# EasyEDA Pro project 3轴6.1--esp32 -(1031) I2S.eprj, schematic 原理图
Board Name: esp32; Create Date: 2025-05-14; Page Name: 电源; Project Name: 3轴6.1--esp32 -(1031) I2S; Schematic Name: 原理图; Update Date: 2025-11-05; Company: 嘉立创EDA; Page Size: A3; Version: V1.0
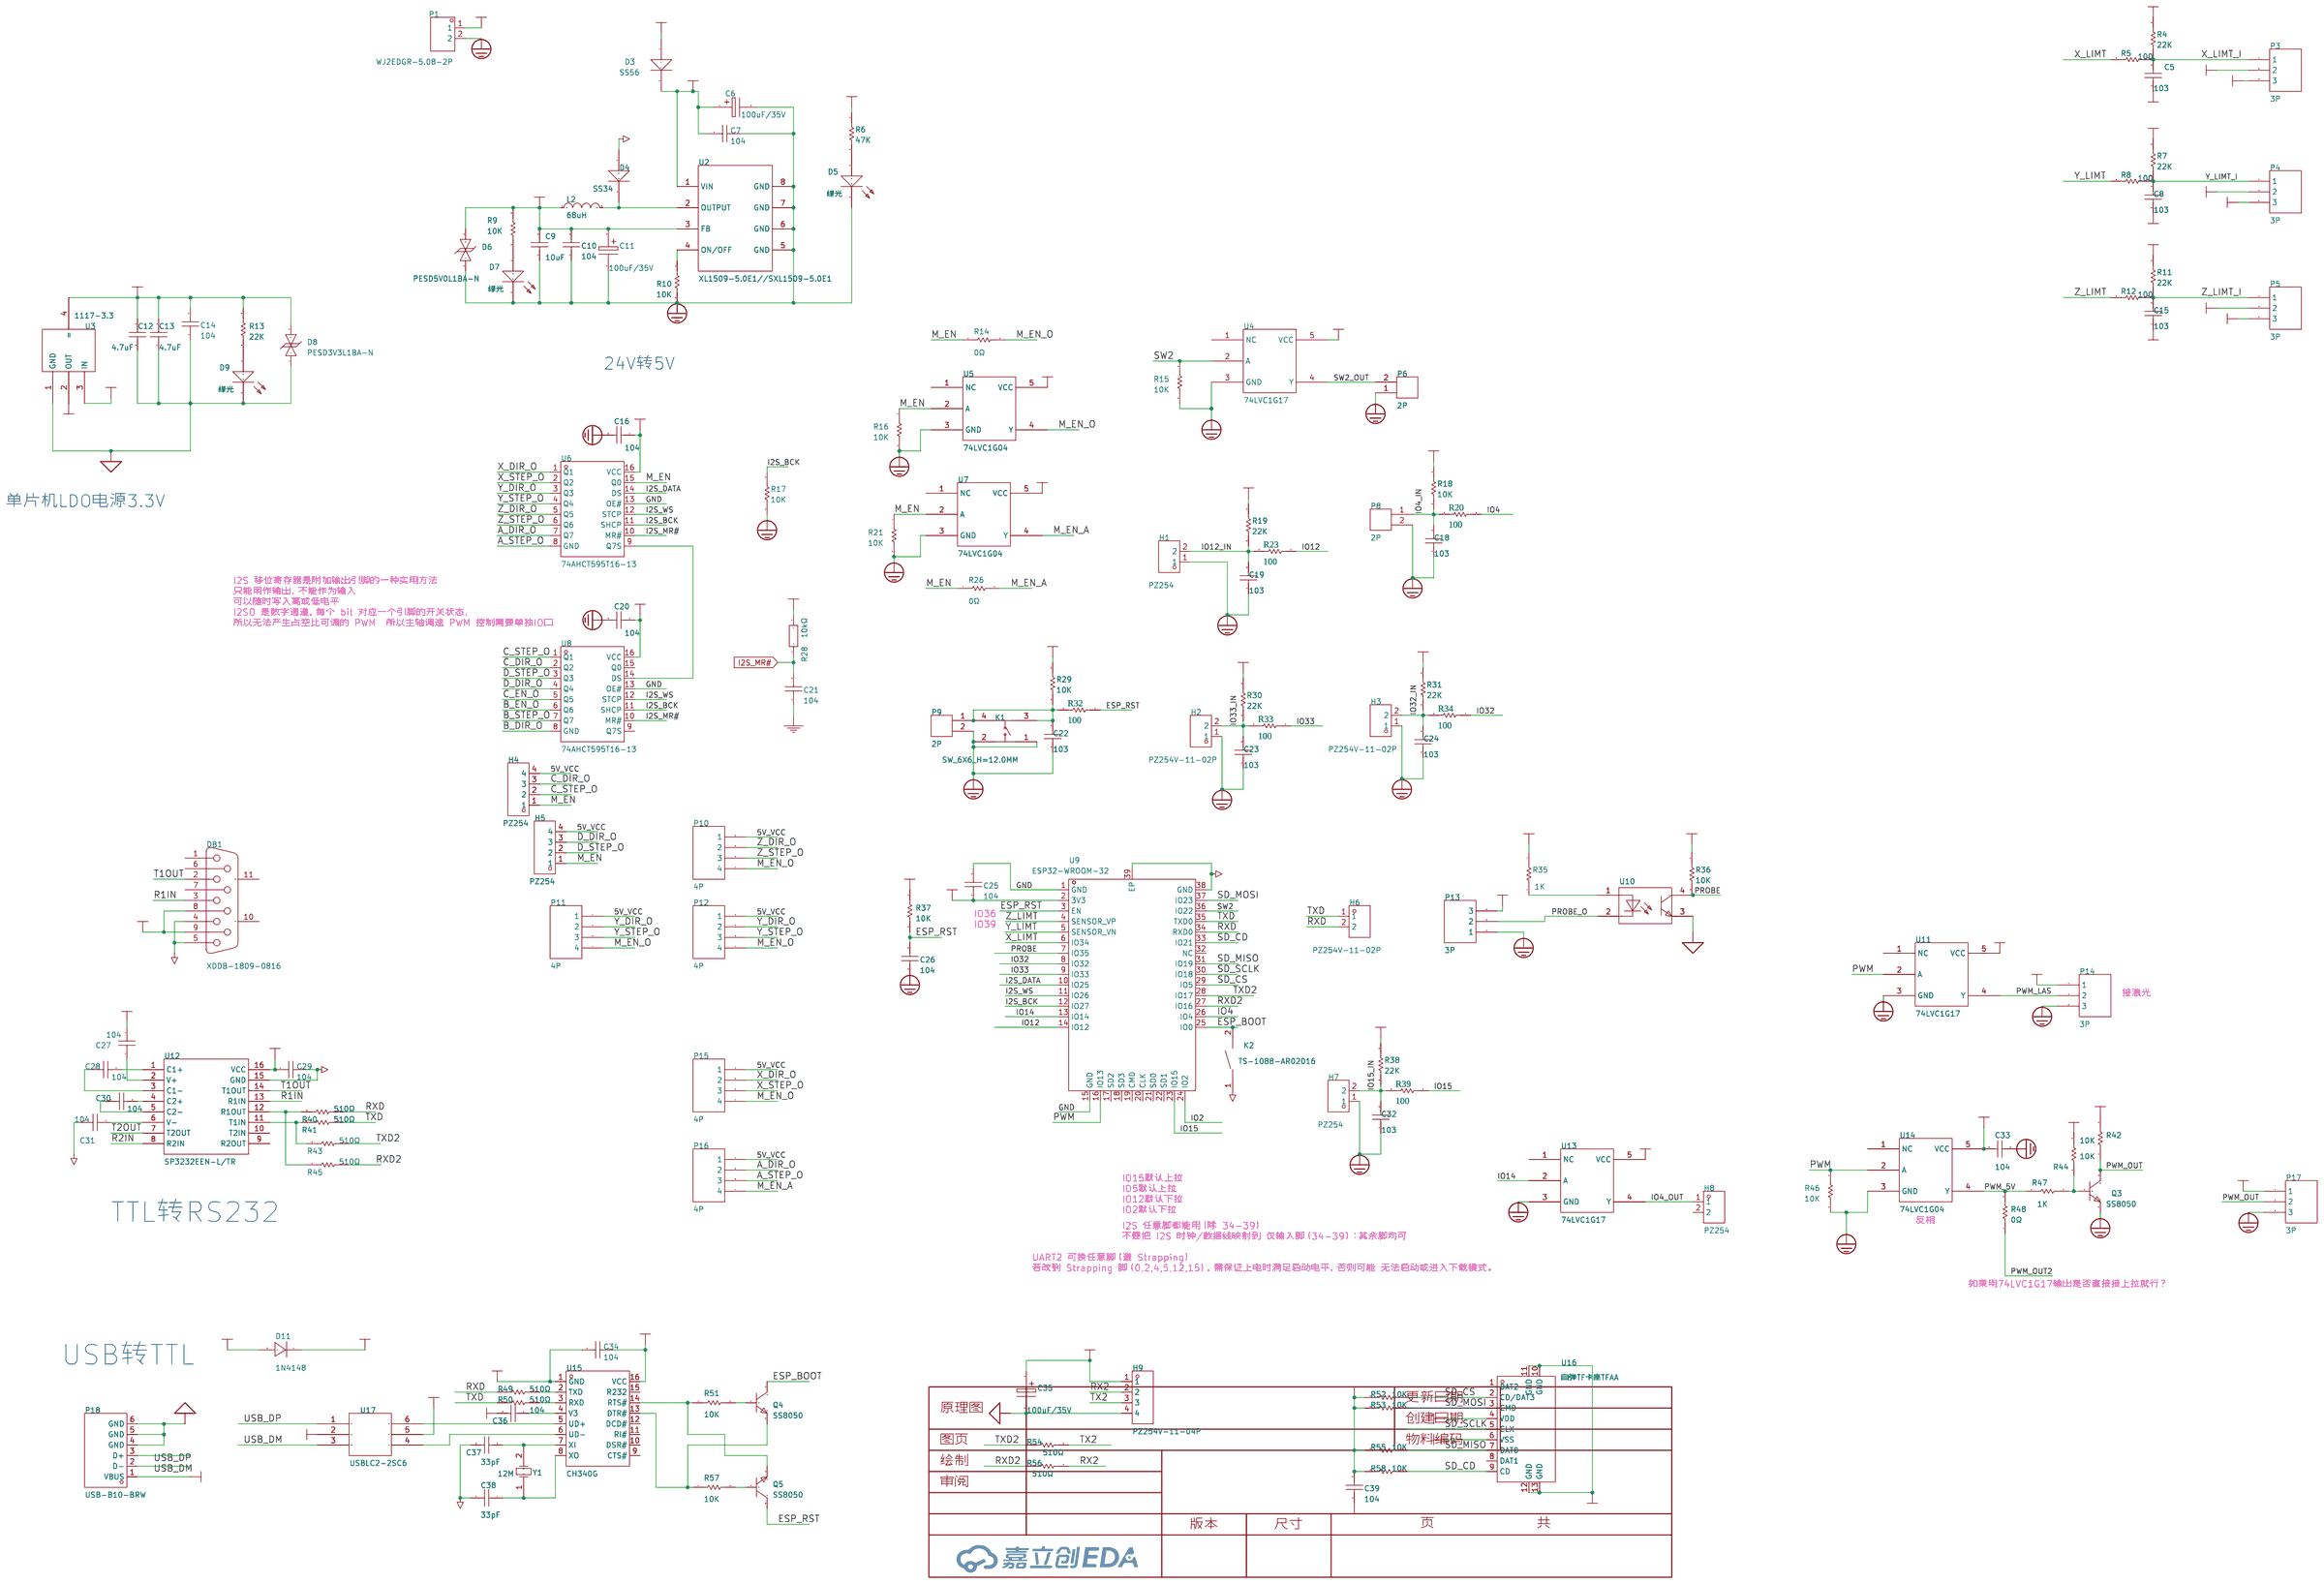
[diagram p0: schematic sheet]

## Parts
C5  103  [11]
C6  100uF/35V  [电解电容贴片6X6]
C7  104  [0603C]
C8  103  [11]
C9  10uF  [C1206]
C10  104  [0603C]
C11  100uF/35V  [电解电容贴片6X6]
C12  4.7uF  [C1206]
C13  4.7uF  [C1206]
C14  104  [0603C]
C15  103  [11]
C16  104  [0603C]
C18  103  [11]
C19  103  [11]
C20  104  [0603C]
C21  104  [0603C]
C22  103  [11]
C23  103  [11]
C24  103  [11]
C25  104  [0603C]
C26  104  [0603C]
C27  104  [0603C]
C28  104  [0603C]
C29  104  [0603C]
C30  104  [0603C]
C31  104  [0603C]
C32  103  [11]
C33  104  [0603C]
C34  104  [0603C]
C35  100uF/35V  [电解电容贴片6X6]
C36  104  [0603C]
C37  18pF  [0603C]
C38  18pF  [0603C]
C39  104  [11]
D3  SS56  [SMA]
D4  SS34  [SMA]
D5  绿光  [0603LED]
D6  PESD5V0L1BA-N  [SOD-323_L1.8-W1.3-LS2.5-BI]
D7  绿光  [0603LED]
D8  PESD3V3L1BA-N  [SOD-323_L1.8-W1.3-LS2.5-BI]
D9  绿光  [0603LED]
D11  1N4148  [SOD-123_L2.8-W1.8-LS3.7-RD]
DB1  XDDB-1809-0816  [DB9-TH_LD09P33E4GV00LF]
H1  PZ254  [HDR-TH_2P-P2.54-V-M]
H2  PZ254V-11-02P  [HDR-TH_2P-P2.54-V-M]
H3  PZ254V-11-02P  [HDR-TH_2P-P2.54-V-M]
H4  PZ254  [HDR-TH_4P-P2.54-V-M]
H5  PZ254  [HDR-TH_4P-P2.54-V-M]
H6  PZ254V-11-02P  [HDR-TH_2P-P2.54-V-M]
H7  PZ254  [HDR-TH_2P-P2.54-V-M]
H8  PZ254  [HDR-TH_2P-P2.54-V-M]
H9  PZ254V-11-04P  [HDR-TH_4P-P2.54-V-M]
K1  SW_6X6_H=12.0MM  [KEY-SMD_4P-L6.0-W6.0-P4.50-LS9.0]
K2  TS-1088-AR02016  [SW-SMD_L3.9-W3.0-P4.45]
L2  68uH  [IND-SMD_L7.0-W7.0_SMDRI74-330MT]
P1  WJ2EDGR-5.08-2P  [CONN-TH_WJ2EDGR-5.08-2P]
P3  3P  [HDR1X3_CON]
P4  3P  [HDR1X3_CON]
P5  3P  [HDR1X3_CON]
P6  2P  [HDR1X2_CON]
P8  2P  [HDR1X2_CON]
P9  2P  [HDR1X2_CON]
P10  4P  [HDR1X4_CON]
P11  4P  [HDR1X4_CON]
P12  4P  [HDR1X4_CON]
P13  3P  [HDR1X3_CON]
P14  3P  [HDR1X3_CON]
P15  4P  [HDR1X4_CON]
P16  4P  [HDR1X4_CON]
P17  3P  [HDR1X3_CON]
P18  USB-B10-BRW  [USB-B-TH_USB-B10-BRW]
Q3  SS8050  [SOT-23-3_L2.9-W1.3-P1.90-LS2.4-BR]
Q4  SS8050  [SOT-23-3_L2.9-W1.3-P1.90-LS2.4-BR]
Q5  SS8050  [SOT-23-3_L2.9-W1.3-P1.90-LS2.4-BR]
R4  22K  [10]
R5  100  [10]
R6  47K  [0603R]
R7  22K  [10]
R8  100  [10]
R9  10K  [0603R]
R10  10K  [0603R]
R11  22K  [10]
R12  100  [10]
R13  10K  [0603R]
R14  0Ω  [0603R]
R15  10K  [0603R]
R16  10K  [0603R]
R17  10K  [0603R]
R18  10K  [0603R]
R19  10K  [0603R]
R20  100  [0603R]
R21  10K  [0603R]
R23  100  [0603R]
R26  0Ω  [0603R]
R28  10kΩ  [R0603]
R29  10K  [0603R]
R30  10K  [0603R]
R31  10K  [0603R]
R32  100  [0603R]
R33  100  [0603R]
R34  100  [0603R]
R35  1K  [0603R]
R36  10K  [0603R]
R37  10K  [0603R]
R38  10K  [0603R]
R39  100  [0603R]
R40  510Ω  [0603R]
R41  510Ω  [0603R]
R42  10K  [0603R]
R43  510Ω  [0603R]
R44  10K  [0603R]
R45  510Ω  [0603R]
R46  10K  [0603R]
R47  1K  [0603R]
R48  0Ω  [0603R]
R49  510Ω  [0603R]
R50  510Ω  [0603R]
R51  10K  [0603R]
R52  10K  [10]
R53  10K  [10]
R54  510Ω  [0603R]
R55  10K  [10]
R56  510Ω  [0603R]
R57  10K  [0603R]
R58  10K  [10]
U2  XL1509-5.0E1//SXL1509-5.0E1  [ESOP-8_L4.9-W3.9-P1.27-LS6.0-BL-EP]
U3  1117-3.3  [SOT-223]
U4  74LVC1G17  [SOT-23-5]
U5  74LVC1G04  [SOT-23-5]
U6  74AHCT595T16-13  [TSSOP-16_L5.0-W4.4-P0.65-LS6.4-BL]
U7  74LVC1G04  [SOT-23-5]
U8  74AHCT595T16-13  [TSSOP-16_L5.0-W4.4-P0.65-LS6.4-BL]
U9  ESP32-WROOM-32  [WIFI-SMD_ESP32-WROOM-32UE-A]
U10  LTV-357T-C  [SOP-4_L4.4-W3.9-P2.54-LS7.0-TL]
U11  74LVC1G17  [SOT-23-5]
U12  SP3232EEN-L/TR  [SOIC-16_L9.9-W3.9-P1.27-LS6.0-BL]
U13  74LVC1G17  [SOT-23-5]
U14  74LVC1G04  [SOT-23-5]
U15  CH340G  [SOIC-16_L9.9-W3.9-P1.27-LS6.0-BL]
U16  自弹TF卡座TFAA  [SIM-SMD_C9900015645]
U17  USBLC2-2SC6  [SOT-23-6]
Y1  12M  [晶振贴片49SSMD]

## Library data of the parts
C5 C8 C15 C18 C19 C22-C24 C32 = 103: Design Item ID: CAP; Library Name: SCH封装库
C6 C11 C35 = 100uF/35V: Origin Footprint 2: X47U; Origin Footprint 1: 电解电容贴片6x6; Design Item ID: ELECTRO1; Library Name: *
C7 C10 C14 C16 C20 C21 C25 C26 C33 = 104: Capacitor (Semiconductor SIM Model); Published: 8-Jun-2000; LatestRevisionDate: 17-Jul-2002; LatestRevisionNote: Re-released for DXP Platform.; PackageReference: C1206; Publisher: Altium Limited; Origin Footprint 2: C1206; Origin Footprint 3: 0402; Origin Footprint 4: 1310[0504]; Origin Footprint 5: 1608[0603]; Origin Footprint 6: C1210; Origin Footprint 7: C0805; Origin Footprint 8: C1206; Origin Footprint 9: 0805; Origin Footprint 10: 0805L; Design Item ID: Cap Semi; Library Name: Miscellaneous Devices
C9 C12 C13 = 104: Design Item ID: CAP; Library Name: SCH--װ--
C27-C31 C34 = 103: Capacitor (Semiconductor SIM Model); Published: 8-Jun-2000; LatestRevisionDate: 17-Jul-2002; LatestRevisionNote: Re-released for DXP Platform.; PackageReference: C1206; Publisher: Altium Limited; Origin Footprint 2: C1206; Origin Footprint 3: 0402; Origin Footprint 4: 1310[0504]; Origin Footprint 5: 1608[0603]; Origin Footprint 6: C1210; Origin Footprint 7: C0805; Origin Footprint 8: C1206; Origin Footprint 9: 0805; Origin Footprint 10: 0805L; Design Item ID: Cap Semi; Library Name: Miscellaneous Devices
C36 = 104: Capacitor (Semiconductor SIM Model); Published: 8-Jun-2000; LatestRevisionDate: 17-Jul-2002; LatestRevisionNote: Re-released for DXP Platform.; PackageReference: C1206; Publisher: Altium Limited; Origin Footprint 2: C1206; Origin Footprint 3: 0402; Origin Footprint 4: 1310[0504]; Origin Footprint 5: 1608[0603]; Origin Footprint 6: C1210; Origin Footprint 7: C0805; Origin Footprint 8: C1206; Origin Footprint 9: 0805; Origin Footprint 10: 0805L; Origin Footprint 11: 0805C; Design Item ID: Cap Semi; Library Name: Miscellaneous Devices
C37 C38 = 33pF: Capacitor (Semiconductor SIM Model); Published: 8-Jun-2000; LatestRevisionDate: 17-Jul-2002; LatestRevisionNote: Re-released for DXP Platform.; PackageReference: C1206; Publisher: Altium Limited; Origin Footprint 2: C1206; Origin Footprint 3: 0402; Origin Footprint 4: 1310[0504]; Origin Footprint 5: 1608[0603]; Origin Footprint 6: C1210; Origin Footprint 7: C0805; Origin Footprint 8: C1206; Origin Footprint 9: 0805; Origin Footprint 10: 0805L; Design Item ID: Cap Semi; Library Name: Miscellaneous Devices
C39 = 104: Capacitor (Semiconductor SIM Model); Published: 8-Jun-2000; LatestRevisionDate: 17-Jul-2002; LatestRevisionNote: Re-released for DXP Platform.; PackageReference: C1206; Publisher: Altium Limited; Origin Footprint 2: C1206; Origin Footprint 3: 0402; Origin Footprint 4: 1310[0504]; Origin Footprint 5: 1608[0603]; Origin Footprint 6: C1210; Origin Footprint 7: C0805; Origin Footprint 8: C1206; Origin Footprint 9: 0805; Origin Footprint 10: 0805L; Origin Footprint 11: 0805C; Origin Footprint 1: 0603C; Design Item ID: Cap Semi; Library Name: Miscellaneous Devices
D3 = SS56: Design Item ID: 1N4148; Library Name: SCH封装库
D4 = SS56: Design Item ID: 1N4148; Library Name: SCH--װ--
D5 D7 D9 = 绿光: Origin Footprint 2: LED(小); Design Item ID: LED; Library Name: SCH封装库
D6 D8 = PESD5V0S1BBN: 极性:Bidirectional;反向关断电压（典型值）:5V (Max);击穿电压（最小值）:6V;箝位电压:15V;峰值脉冲电流（10/1000us）:5A (8/20us);; Supplier Part: C314264; Manufacturer: BORN伯恩半导体; Supplier Footprint: SOD-523; JLCPCB Part Class: Extended Part; Datasheet: https://atta.szlcsc.com/upload/public/pdf/source/20181015/C314264_F9AC5761AC2631DA841FBD1D9C6821E3.pdf; Supplier: LCSC; Polarity: Bidirectional; Voltage - Reverse Standoff (Typ): 5V (Max); Voltage - Breakdown (Min): 6V; Voltage - Clamping (Max) @ Ipp: 15V; Current - Peak Pulse (10/1000μs): 5A (8/20us)
D11 = 1N4148W-E3-08: LCSC Part Name: 100V 150mA 4ns; Supplier Part: C241939; Manufacturer: VISHAY(威世); Supplier Footprint: SOD-123; JLCPCB Part Class: Extended Part; Datasheet: https://atta.szlcsc.com/upload/public/pdf/source/20180719/C241939_AB5601D33C939ACDC04F46818C9B4736.pdf; Supplier: LCSC; Power Dissipation: 350mW; Reverse Voltage (Vr): 100V; Average Rectified Current (Io): 150mA; Forward Voltage (Vf@If): 1.2V@100mA; Reverse Leakage Current: 100μA@100V; Reverse Recovery Time (trr): 4ns; Operating Temperature: +150℃@(Tj)
DB1 = XDDB-1809-0816: LCSC Part Name: D-Sub 公 P数:9P; Supplier Part: C7498157; Manufacturer: LX(连欣科技); Supplier Footprint: 插件; JLCPCB Part Class: 扩展库; Datasheet: https://atta.szlcsc.com/upload/public/pdf/source/20230825/11AC0D8BC28315CABA4F65E63009CD5C.pdf; Supplier: LCSC; Connector Type: 常规D-Sub; Gender: 公; Number of Pins: 9P; Mounting Style: 弯插; Number of Rows: 2; Current Rating-Signal (Max): 3A; Rated Voltage (Max): 100V; Operating Temperature Range: -40℃~+85℃
H1-H3 H6-H8 = PZ254V-11-02P: 插针结构:1x2P;间距:2.54mm;行距:-;圆针/方针:方针;安装类型:直插;排数:单排;总PIN位数:2P;额定电流:-;额定电压:-;配合针长度:6mm;塑高:2.5mm;端接针长度:3mm;触头材质:黄铜;触头镀层:-;工作温度范围:-40℃~+105℃;颜色:黑色;; LCSC Part Name: 间距:2.54mm 1x2P 直插 方针; Supplier Part: C492401; Manufacturer: XFCN(兴飞); Supplier Footprint: 插件,P=2.54mm; JLCPCB Part Class: 扩展库; Datasheet: https://atta.szlcsc.com/upload/public/pdf/source/20200309/C492401_A812433581A9B211A7FFA413ADDFF0E5.pdf; Supplier: LCSC; Pin Structure: 1x2P; Pitch: 2.54mm; Circluar Pins/Square Pins: 方针; Mounting Type: 直插; Number of Rows: 单排; Number of Pins: 2P; Length of Mating Pin: 6mm; Insulation Height: 2.5mm; Length of End Connection Pin: 3mm; Contact Material: 黄铜; Operating Temperature Range: -40℃~+105℃; Color: 黑色
H4 H5 H9 = PZ254V-11-04P: LCSC Part Name: 1x4P 间距:2.54mm 方针 直插; Supplier Part: C2691448; Manufacturer: XFCN(兴飞); Supplier Footprint: 插件,P=2.54mm; JLCPCB Part Class: 扩展库; Datasheet: https://item.szlcsc.com/datasheet/PZ254V-11-04P/2801085.html; Supplier: LCSC; Pin Structure: 1x4P; Pitch: 2.54mm; Circluar Pins/Square Pins: 方针; Mounting Type: 直插; Number of Rows: 单排; Number of Pins: 4P; Current Rating: 3A; Voltage Rating (Max): 250V; Length of Mating Pin: 6mm; Insulation Height: 2.5mm; Length of End Connection Pin: 3mm; Operating Temperature: -40℃~+105℃; Color: 黑色
K1 = SW_6X6_H=12.0MM: Supplier Part: C9900018802; Supplier Footprint: KEY-SMD; JLCPCB Part Class: 扩展库; Supplier: LCSC
K2 = TS-1088-AR02016: 电路结构:单刀单掷;按钮形状:圆形按钮;作用力:160gf;安装方式:立贴;开关长度:4mm;开关宽度:3mm;开关高度:2mm;带支架:不带;触点电流:50mA;额定电压(DC):12V;绝缘电阻:100MΩ;机械寿命:10万次;; LCSC Part Name: 4*3*2mm 立贴 轻触开关; Supplier Part: C720477; Manufacturer: XUNPU(讯普); Supplier Footprint: SMD; JLCPCB Part Class: 基础库; Datasheet: https://atta.szlcsc.com/upload/public/pdf/source/20200810/C720475_60D09DD6C54279ADDB2DC25100F1CC11.pdf; Supplier: LCSC; Circuit: 单刀单掷; Actuator Style: 圆形按钮; Operating Force: 160gf; Mounting Style: 立贴; Switch Length: 4mm; Switch Width: 3mm; Switch Height: 2mm; Strike Gundam: 不带; Contact Current: 50mA; Voltage Rating (DC): 12V; Insulation Resistance: 100MΩ; Actuator/Cap Color: 黑色; Pin Style: SMD接片; Mechanical Life: 10万次; Operating Temperature: -30℃~+80℃
L2 = SMDRI74-330MT: 电感值:33uH;精度:±20%;额定电流:960mA;饱和电流(Isat):1.8A;类型:屏蔽电感;; LCSC Part Name: 33uH±20%1.8A; Supplier Part: C49625; Manufacturer: SXN(顺翔诺); Supplier Footprint: SMD,7.5x7.5mm; JLCPCB Part Class: 扩展库; Datasheet: https://atta.szlcsc.com/upload/public/pdf/source/20210810/6F96FDC19AA308DD2AD166FFB9640E87.pdf; Supplier: LCSC; Tolerance: ±20%; Rated Current: 960mA; Saturation Current (Isat): 1.8A; DC Resistance (DCR): 170mΩ; Type: 屏蔽电感
P1 = WJ2EDGR-5.08-2P: 每排PIN数:2;安装方式:弯针;排数:1;间距:5.08mm;连接器类型:板端/插座-开口;; LCSC Part Name: 插针/板端 弯针 2P 5.08mm; Supplier Part: C8383; Manufacturer: KANGNEX(康奈克斯电气); Supplier Footprint: P=5.08mm; JLCPCB Part Class: Extended Part; Datasheet: https://atta.szlcsc.com/upload/public/pdf/source/20191225/C8383_DE80ABD4B75356B45B295FA186A21D08.pdf; Supplier: LCSC; Number of PINs Per Row: 2; Mounting Sytle: 弯针; Number of Rows: 1; Pitch: 5.08mm; Connector Type: 板端/插座-开口
P3-P5 P13 P14 P17 = 3P: Library Name: SCH封装库
P6 P8 P9 = 2P: Library Name: SCH--װ--
P10-P12 P15 P16 = 4P: Library Name: SCH封装库
P18 = USB-B10-BRW: 连接器类型:Type-B;标准:USB 2.0;公母:母;端口数量:1;触点数量:4P;安装方式:弯插;额定电流 - 电源:1.5A;工作温度范围:-20℃~+70℃;焊接温度(最大值):260℃;; LCSC Part Name: Type-B母弯插; Supplier Part: C720549; Manufacturer: XUNPU(讯普); Supplier Footprint: 插件; JLCPCB Part Class: 扩展库; Datasheet: https://atta.szlcsc.com/upload/public/pdf/source/20200812/C720549_53E9294752E2933874870440E626C579.pdf; Supplier: LCSC; Connector Type: Type-B; Standard: USB2.0; Gender: 母; Number of Ports: 1; Number of Contacts: 4P; Mounting Style: 弯插; Current Rating - Power (Max): 1.5A; Operating Temperature Range: -20℃~+70℃; Soldering Temperature(Max): 260℃
Q3 = SS8050: 晶体管类型:NPN;集射极击穿电压(Vceo):25V;集电极电流(Ic):1.5A;功率(Pd):300mW;集电极-发射极饱和电压(VCE(sat)@Ic,Ib):500mV@800mA,80mA;直流电流增益(hFE@Ic,Vce):200@100mA,1V;特征频率(fT):100MHz;工作温度:+150℃@(Tj);; LCSC Part Name: SS8050 Y1 200-350 Y1 200-350; Supplier Part: C2150; Manufacturer: CJ（江苏长电/长晶）; Supplier Footprint: SOT-23(SOT-23-3); JLCPCB Part Class: Basic Part; Datasheet: https://atta.szlcsc.com/upload/public/pdf/source/20140809/1457707209319.pdf; Supplier: LCSC; Transistor Type: NPN; Collector-Emitter Breakdown Voltage (Vceo): 25V; Collector Current (Ic): 1.5A; Power Dissipation (Pd): 300mW; Collector-Emitter Saturation Voltage (VCE(sat)@Ic,Ib): 500mV@800mA,80mA; DC Current Gain (hFE@Ic,Vce): 200@100mA,1V; Transition Frequency (fT): 100MHz; Operating Temperature: +150℃@(Tj)
Q4 Q5 = SS8050: LCSC Part Name: NPN 25V 1.5A 120-400 SOT-23; Supplier Part: C2931717; Manufacturer: Doeshare(德芯); Supplier Footprint: SOT-23; JLCPCB Part Class: 扩展库; Datasheet: https://atta.szlcsc.com/upload/public/pdf/source/20220106/99F9A3DFCBDD91265C711555CE6390BF.pdf; Supplier: LCSC
R4 R7 R11 R52 R53 R55 R58 = 10K: Resistor; Published: 8-Jun-2000; LatestRevisionDate: 17-Jul-2002; LatestRevisionNote: Re-released for DXP Platform.; PackageReference: AXIAL-0.3; Publisher: Altium Limited; Origin Footprint 2: AXIAL-0.3; Origin Footprint 3: R0805; Origin Footprint 4: 0805R; Origin Footprint 1: 0603R; Design Item ID: RES; Library Name: SCH封装库
R5 R8 R12 = 100: Resistor; Published: 8-Jun-2000; LatestRevisionDate: 17-Jul-2002; LatestRevisionNote: Re-released for DXP Platform.; PackageReference: AXIAL-0.3; Publisher: Altium Limited; Origin Footprint 2: AXIAL-0.3; Origin Footprint 3: R0805; Origin Footprint 4: 0805R; Origin Footprint 1: 0603R; Design Item ID: RES; Library Name: SCH封装库
R6 = 1K: Resistor; Published: 8-Jun-2000; LatestRevisionDate: 17-Jul-2002; LatestRevisionNote: Re-released for DXP Platform.; PackageReference: AXIAL-0.3; Publisher: Altium Limited; Origin Footprint 2: AXIAL-0.3; Origin Footprint 3: R0805; Origin Footprint 4: 0805R; Design Item ID: RES; Library Name: SCH封装库
R9 R13 R17-R19 R29-R31 R36-R38 R51 R57 = 10K: Resistor; Published: 8-Jun-2000; LatestRevisionDate: 17-Jul-2002; LatestRevisionNote: Re-released for DXP Platform.; PackageReference: AXIAL-0.3; Publisher: Altium Limited; Origin Footprint 2: AXIAL-0.3; Origin Footprint 3: R0805; Origin Footprint 4: 0805R; Design Item ID: RES; Library Name: SCH封装库
R10 = 10k: Resistor; Published: 8-Jun-2000; LatestRevisionDate: 17-Jul-2002; LatestRevisionNote: Re-released for DXP Platform.; PackageReference: AXIAL-0.3; Publisher: Altium Limited; Origin Footprint 2: AXIAL-0.3; Origin Footprint 3: R0805; Origin Footprint 4: 0805R; Design Item ID: RES; Library Name: SCH封装库
R14-R16 R21 R26 R42 R44 R46 = 10K: Resistor; Published: 8-Jun-2000; LatestRevisionDate: 17-Jul-2002; LatestRevisionNote: Re-released for DXP Platform.; PackageReference: AXIAL-0.3; Publisher: Altium Limited; Origin Footprint 2: AXIAL-0.3; Origin Footprint 3: R0805; Origin Footprint 4: 0805R; Design Item ID: RES; Library Name: SCH--װ--
R20 R23 R32-R34 R39 R47 R48 = 100: Resistor; Published: 8-Jun-2000; LatestRevisionDate: 17-Jul-2002; LatestRevisionNote: Re-released for DXP Platform.; PackageReference: AXIAL-0.3; Publisher: Altium Limited; Origin Footprint 2: AXIAL-0.3; Origin Footprint 3: R0805; Origin Footprint 4: 0805R; Design Item ID: RES; Library Name: SCH--װ--
R28 = 10kΩ: Supplier: LCSC; Manufacturer: UniOhm; Manufacturer Part: 0603WAF1002T5E; Supplier Part: C25804; Resistance: 10K; JLCPCB Part Class: Basic Part
R35 = 470Ω: Resistor; Published: 8-Jun-2000; LatestRevisionDate: 17-Jul-2002; LatestRevisionNote: Re-released for DXP Platform.; PackageReference: AXIAL-0.3; Publisher: Altium Limited; Origin Footprint 2: AXIAL-0.3; Origin Footprint 3: R0805; Origin Footprint 4: 0805R; Design Item ID: RES; Library Name: SCH封装库
R40 R41 R43 R45 R49 R50 R54 R56 = 100: Resistor; Published: 8-Jun-2000; LatestRevisionDate: 17-Jul-2002; LatestRevisionNote: Re-released for DXP Platform.; PackageReference: AXIAL-0.3; Publisher: Altium Limited; Origin Footprint 2: AXIAL-0.3; Origin Footprint 3: R0805; Origin Footprint 4: 0805R; Design Item ID: RES; Library Name: SCH封装库
U2 = XL1509-5.0E1: 功能类型:降压型;同步整流:-;输出通道数:-;拓扑结构:-;输入电压:-;输出电流(最大值):-;开关频率:-;; LCSC Part Name: 降压型; Supplier Part: C61063; Manufacturer: XLSEMI(芯龙); Supplier Footprint: SOP-8_150mil; JLCPCB Part Class: Basic Part; Datasheet: https://atta.szlcsc.com/upload/public/pdf/source/20151020/1457707483545.pdf; Supplier: LCSC; Function: 降压型
U3 = 1117-3.3: Design Item ID: LM1117; Library Name: Party600
U4 U11 U13 = 74LVC1G04: Library Name: SCH--װ--
U5 U7 U14 = 74LVC1G04: Design Item ID: 74LVC1G17; Library Name: SCH--װ--
U6 U8 = 74AHCT595T16-13: 功能:串行至串行或并行;工作电压:4.5V~5.5V;元件数:1;每个元件位数:8;; Supplier Part: C460504; Manufacturer: DIODES(美台); Supplier Footprint: TSSOP-16; JLCPCB Part Class: 扩展库; Datasheet: https://atta.szlcsc.com/upload/public/pdf/source/20181012/C126402_1C2CD61366A0E74343C8903136947225.pdf; Supplier: LCSC; Function: 串行至串行或并行; Voltage - Supply: 4.5V~5.5V; Number of Elements: 1; Number of Bits per Element: 8; Output Type: 三态; Series: 74AHCT; Operating Temperature: -40℃~+125℃
U9 = ESP32-WROOM-32: Supplier Part: C95209; Manufacturer: ESPRESSIF(乐鑫); JLCPCB Part Class: 扩展库; Datasheet: https://atta.szlcsc.com/upload/public/pdf/source/20170925/C95209_1506321763821990573.pdf; Supplier: LCSC
U10 = LTV-357T-C: 输入电压类型:DC;正向电压:1.2V;输出电流:50mA;隔离电压(rms):3.75kV;反向电压:6V;接收端电压:35V;输出通道数:1;集射极饱和电压(Vce(sat)@Ic,IF):200mV@1mA,20mA;; Supplier: LCSC; Manufacturer: LITEON(光宝); Supplier Part: C119091; JLCPCB Part Class: 扩展库; LCSC Part Name: DC输入隔离电压(rms):3750V; Supplier Footprint: SOP-4-2.54mm; Datasheet: https://atta.szlcsc.com/upload/public/pdf/source/20170930/C133128_1506736380934997376.pdf; Input voltage type: DC; Output Type: 光电三极管; Forward Voltage: 1.2V; Output Current: 50mA; Isolation Voltage(rms): 3.75kV; Reverse Voltage: 6V; Receiving End Voltage: 35V; Number of Outputs: 1; Collector-Emitter Saturation Voltage (Vce(sat)@Ic,IF): 200mV@1mA,20mA; Rise time: 4us@2mA,100Ω; Fall time: 3us@2mA,100Ω; Operating Temperature: -55℃~+110℃
U12 = SP3232EEN-L/TR: LCSC Part Name: True3.0V至5.5V RS-232收发器; Supplier Part: C9378; Manufacturer: MaxLinear(迈凌); Supplier Footprint: SOIC-16; JLCPCB Part Class: 扩展库; Datasheet: https://item.szlcsc.com/datasheet/SP3232EEN-L%252FTR/9907.html; Supplier: LCSC; Type: 收发器; Number of Drivers: 2; Number of Receivers: 2; Data Rate: 235Kbps; Voltage - Supply: 3V~5.5V; Operating Temperature: -40℃~+85℃
U15 = CH340G: 应用功能:收发器;接口协议:USB 2.0;数据速率:2Mbps;; LCSC Part Name: USB转串口芯片 CH340; Supplier Part: C14267; Manufacturer: WCH(南京沁恒); Supplier Footprint: SOP-16; JLCPCB Part Class: 扩展库; Datasheet: https://atta.szlcsc.com/upload/public/pdf/source/20230530/6E401E9554E9F5311886CC8B3F89B62E.pdf; Supplier: LCSC; Applications Function: 收发器; Protocol: USB 2.0; Supply Voltage: 3.3V；5V; Data Rate: 2Mbps
U16 = 自弹TF卡座TFAA: Supplier Part: C9900015645; Supplier Footprint: SMD; JLCPCB Part Class: 扩展库; Supplier: LCSC
U17 = USBLC2-2SC6: Design Item ID: DIP6; Library Name: SCH封装库
Y1 = 12M: Crystal Oscillator; Published: 8-Jun-2000; LatestRevisionDate: 17-Jul-2002; LatestRevisionNote: Re-released for DXP Platform.; PackageReference: R38; Publisher: Altium Limited; Origin Footprint 2: R38; Origin Footprint 3: XTAL-49S; Design Item ID: XTAL; Library Name: Miscellaneous Devices

## Nets
3V3: C12.2 C13.2 C14.2 C25.1 C39.2 D8.2 R13.2 R18.1 R29.1 R36.1 R37.1 R52.2 R53.2 R55.2 R58.2 U3.2(OUT) U3.4(=) U9.2(3V3) U16.4(VDD)
5V_VCC: C9.1 C10.2 C11.1 C16.1 C20.1 C27.1 C29.2 C33.2 C34.1 C35.1 D6.2 D11.1(K) H4.4 H5.4 H9.1 L2.1 P3.3 P4.3 P5.3 P10.1 P11.1 P12.1 P13.3 P15.1 P16.1 P17.1 R4.2 R7.2 R9.2 R11.2 R19.1 R28.2 R30.1 R31.1 R35.1 R38.1 R42.2 R44.2 U2.3(FB) U3.3(IN) U4.5(VCC) U5.5(VCC) U6.16(VCC) U7.5(VCC) U8.16(VCC) U11.5(VCC) U12.16(VCC) U13.5(VCC) U14.5(VCC) U15.16(VCC)
24V: D3.1 DB1.8 DB1.9 P1.1 P14.1 R6.2
GND: C5.1 C6.2 C7.1 C8.1 C9.2 C10.1 C11.2 C12.1 C13.1 C14.1 C15.1 C16.2 C18.1 C19.1 C20.2 C21.1 C22.1 C23.1 C24.1 C25.2 C26.1 C29.1 C31.2 C32.1 C33.1 C34.2 C35.2 C36.2 C37.2 C38.2 C39.1 D4.1 D5.2 D6.1 D7.2 D8.1 D9.2 DB1.4 DB1.5 H1.1 H2.1 H3.1 H7.1 H9.4 K1.1 K1.2 K2.1 P1.2 P3.2 P4.2 P5.2 P6.1 P8.2 P9.2 P13.1 P14.3 P17.3 P18.4(GND) P18.5(GND) P18.6(GND) Q3.2(E) R10.2 R15.2 R16.2 R17.2 R21.2 R46.2 U2.5(GND) U2.6(GND) U2.7(GND) U2.8(GND) U3.1(GND) U4.3(GND) U5.3(GND) U6.13(OE#) U7.3(GND) U8.13(OE#) U9.1(GND) U9.15(GND) U9.38(GND) U9.39(EP) U10.3 U11.3(GND) U12.15(GND) U13.3(GND) U14.3(GND) U15.1(GND) U16.6(VSS) U16.10(GND) U16.11(GND) U16.12(GND) U16.13(GND) U17.2
VIN_24V: C6.1 C7.2 D3.2 U2.1(VIN)
A_DIR_O: P16.2 U6.7(Q7)
A_STEP_O: P16.3 U6.8(GND)
B_DIR_O: U8.8(GND)
B_EN_O: U8.6(Q6)
B_STEP_O: U8.7(Q7)
C_DIR_O: H4.3 U8.2(Q2)
C_EN_O: U8.5(Q5)
C_STEP_O: H4.2 U8.1(Q1)
D_DIR_O: H5.3 U8.4(Q4)
D_STEP_O: H5.2 U8.3(Q3)
ESP_BOOT: K2.2 Q4.3(C) U9.25(IO0)
ESP_RST: C26.2 Q5.3(C) R32.1 R37.2 U9.3(EN)
I2S_BCK: R17.1 U6.11(SHCP) U8.11(SHCP) U9.12(IO27)
I2S_DATA: U6.14(DS) U9.10(IO25)
I2S_MR#: C21.2 R28.1 U6.10(MR#) U8.10(MR#)
I2S_WS: U6.12(STCP) U8.12(STCP) U9.11(IO26)
IO2: U9.24(IO2)
IO4: R20.1 U9.26(IO4)
IO4_IN: C18.2 P8.1 R18.2 R20.2
IO4_OUT: H8.1 U13.4(Y)
IO12: R23.1 U9.14(IO12)
IO12_IN: C19.2 H1.2 R19.2 R23.2
IO14: U9.13(IO14) U13.2(A)
IO15: R39.1 U9.23(IO15)
IO15_IN: C32.2 H7.2 R38.2 R39.2
IO32: R34.1 U9.8(IO32)
IO32_IN: C24.2 H3.2 R31.2 R34.2
IO33: R33.1 U9.9(IO33)
IO33_IN: C23.2 H2.2 R30.2 R33.2
M_EN: H4.1 H5.1 R14.1 R16.1 R21.1 R26.1 U5.2(A) U6.15(Q0) U7.2(A)
M_EN_A: P16.4 R26.2 U7.4(Y)
M_EN_O: P10.4 P11.4 P12.4 P15.4 R14.2 U5.4(Y)
PROBE: R36.2 U9.7(IO35) U10.4
PROBE_O: P13.2 U10.2
PWM: R46.1 U9.16(IO13) U11.2(A) U14.2(A)
PWM_5V: R47.1 R48.2 U14.4(Y)
PWM_LAS: P14.2 U11.4(Y)
PWM_OUT: P17.2 Q3.3(C) R42.1
PWM_OUT2: R48.1
R1IN: DB1.3 U12.13(R1IN)
R2IN: U12.8(R2IN)
RX2: H9.2 R56.2
RXD: H6.2 R40.1 R49.2 U9.34(RXD0)
RXD2: R45.1 R56.1 U9.27(IO16)
SD_CD: R58.1 U9.33(IO21) U16.9(CD)
SD_CS: R52.1 U9.29(IO5) U16.2(CD/DAT3)
SD_MISO: R55.1 U9.31(IO19) U16.7(DAT0)
SD_MOSI: R53.1 U9.37(IO23) U16.3(CMD)
SD_SCLK: U9.30(IO18) U16.5(CLX)
SW2: R15.1 U4.2(A) U9.36(IO22)
SW2_OUT: P6.2 U4.4(Y)
T1OUT: DB1.2 U12.14(T1OUT)
T2OUT: U12.7(T2OUT)
TX2: H9.3 R54.2
TXD: H6.1 R41.1 R50.2 U9.35(TXD0)
TXD2: R43.1 R54.1 U9.28(IO17)
USB_DM: P18.2(D-) U17.3
USB_DP: P18.3(D+) U17.1
VUSB: D11.2(A) P18.1(VBUS) U17.5
X_DIR_O: P15.2 U6.1(Q1)
X_LIMT: R5.2 U9.6(IO34)
X_LIMT_I: C5.2 P3.1 R4.1 R5.1
X_STEP_O: P15.3 U6.2(Q2)
Y_DIR_O: P11.2 P12.2 U6.3(Q3)
Y_LIMT: R8.2 U9.5(SENSOR_VN)
Y_LIMT_I: C8.2 P4.1 R7.1 R8.1
Y_STEP_O: P11.3 P12.3 U6.4(Q4)
Z_DIR_O: P10.2 U6.5(Q5)
Z_LIMT: R12.2 U9.4(SENSOR_VP)
Z_LIMT_I: C15.2 P5.1 R11.1 R12.1
Z_STEP_O: P10.3 U6.6(Q6)
$9N72390: D4.2 L2.2 U2.2(OUTPUT)
$9N72392: R10.1 U2.4(ON/OFF)
$9N72730: D5.1 R6.1
$9N85928: C36.1 U15.4(V3)
$9N85949: U15.5(UD+) U17.6
$9N85958: U15.6(UD-) U17.4
$9N85962: C37.1 U15.7(XI) Y1.2(OSC2)
$9N85965: C38.1 U15.8(XO) Y1.1(OSC1)
$9N86544: R49.1 U15.2(TXD)
$9N86546: R50.1 U15.3(RXD)
$9N86982: Q4.2(E) R57.1 U15.13(DTR#)
$9N86987: Q5.2(E) R51.1 U15.14(RTS#)
$9N89334: Q4.1(B) R51.2
$9N89338: Q5.1(B) R57.2
$9N98710: C22.2 K1.3 K1.4 P9.1 R29.2 R32.2
$9N100840: D9.1 R13.1
$9N100955: D7.1 R9.1
$9N120731: U6.9(Q7S) U8.14(DS)
$9N139555: Q3.1(B) R44.1 R47.2
$9N144738: R41.2 R43.2 U12.11(T1IN)
$9N144781: R40.2 R45.2 U12.12(R1OUT)
$9N144999: R35.2 U10.1
$9N145132: C31.1 U12.6(V-)
$9N145210: C27.2 U12.2(V+)
$9N145285: C30.2 U12.4(C2+)
$9N145289: C30.1 U12.5(C2-)
$9N145296: C28.2 U12.1(C1+)
$9N145300: C28.1 U12.3(C1-)

Not connected (* = marked no-connect by the designer): DB1 1 6 7 10(MH1) 11(MH2); H8 2; U4 1(NC); U5 1(NC); U7 1(NC); U8 9(Q7S) 15(Q0); U9 17(SD2) 18(SD3) 19(CMD) 20(CLK) 21(SD0) 22(SD1) 32(NC); U11 1(NC); U12 9(R2OUT) 10(T2IN); U13 1(NC); U14 1(NC); U15 9(CTS#) 10(DSR#) 11(RI#) 12(DCD#) 15(R232); U16 1(DAT2) 8(DAT1)

## Notes on the sheet
- 24V转5V
- 单片机LDO电源3.3V
- I2S 移位寄存器是附加输出引脚的一种实用方法
  只能用作输出，不能作为输入
  可以随时写入高或低电平
  I2SO 是数字通道，每个 bit 对应一个引脚的开关状态，
  所以无法产生占空比可调的 PWM  所以主轴调速 PWM 控制需要单独IO口
- IO36
- IO39
- 接激光
- IO15默认上拉
  IO5默认上拉
  IO12默认下拉
  IO2默认下拉
- TTL转RS232
- I2S 任意脚都能用（除 34-39）
  不要把 I2S 时钟/数据线映射到 仅输入脚（34-39）；其余脚均可
- 反相
- UART2 可换任意脚（避 Strapping）
  若改到 Strapping 脚（0,2,4,5,12,15），需保证上电时满足启动电平，否则可能 无法启动或进入下载模式。
- 如果用74LVC1G17输出是否直接接上拉就行？
- USB转TTL
